# Altium schematic sheet POWER_SUPPLY_220V.SchDoc
size A1
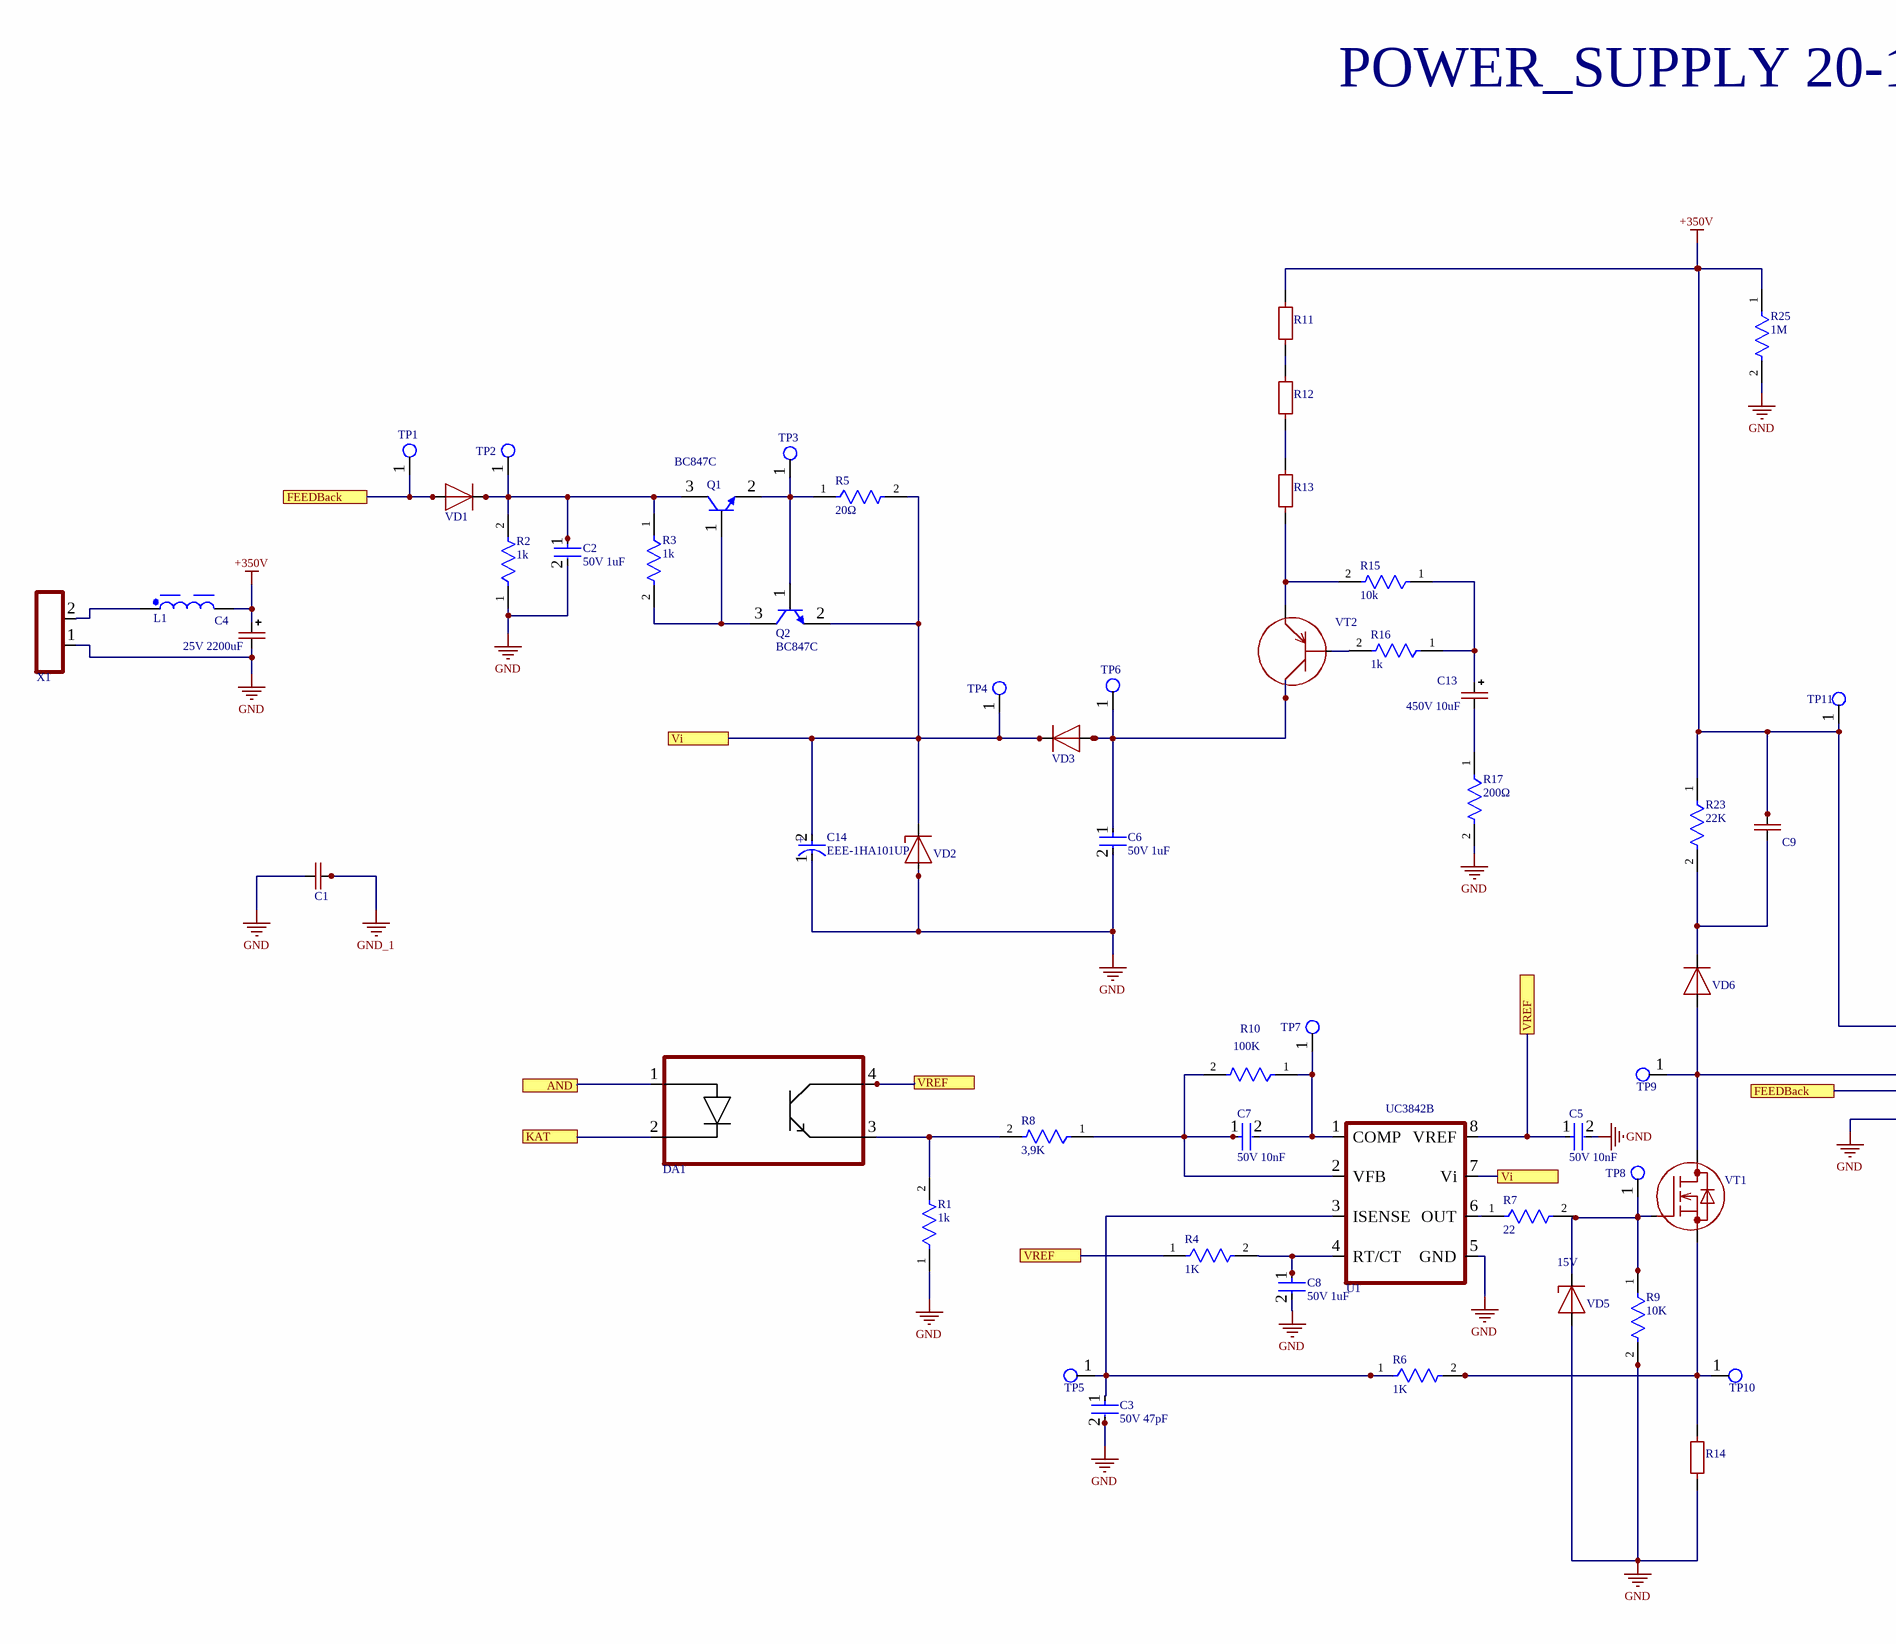
[diagram p0: POWER_SUPPLY_220V.SchDoc, left]
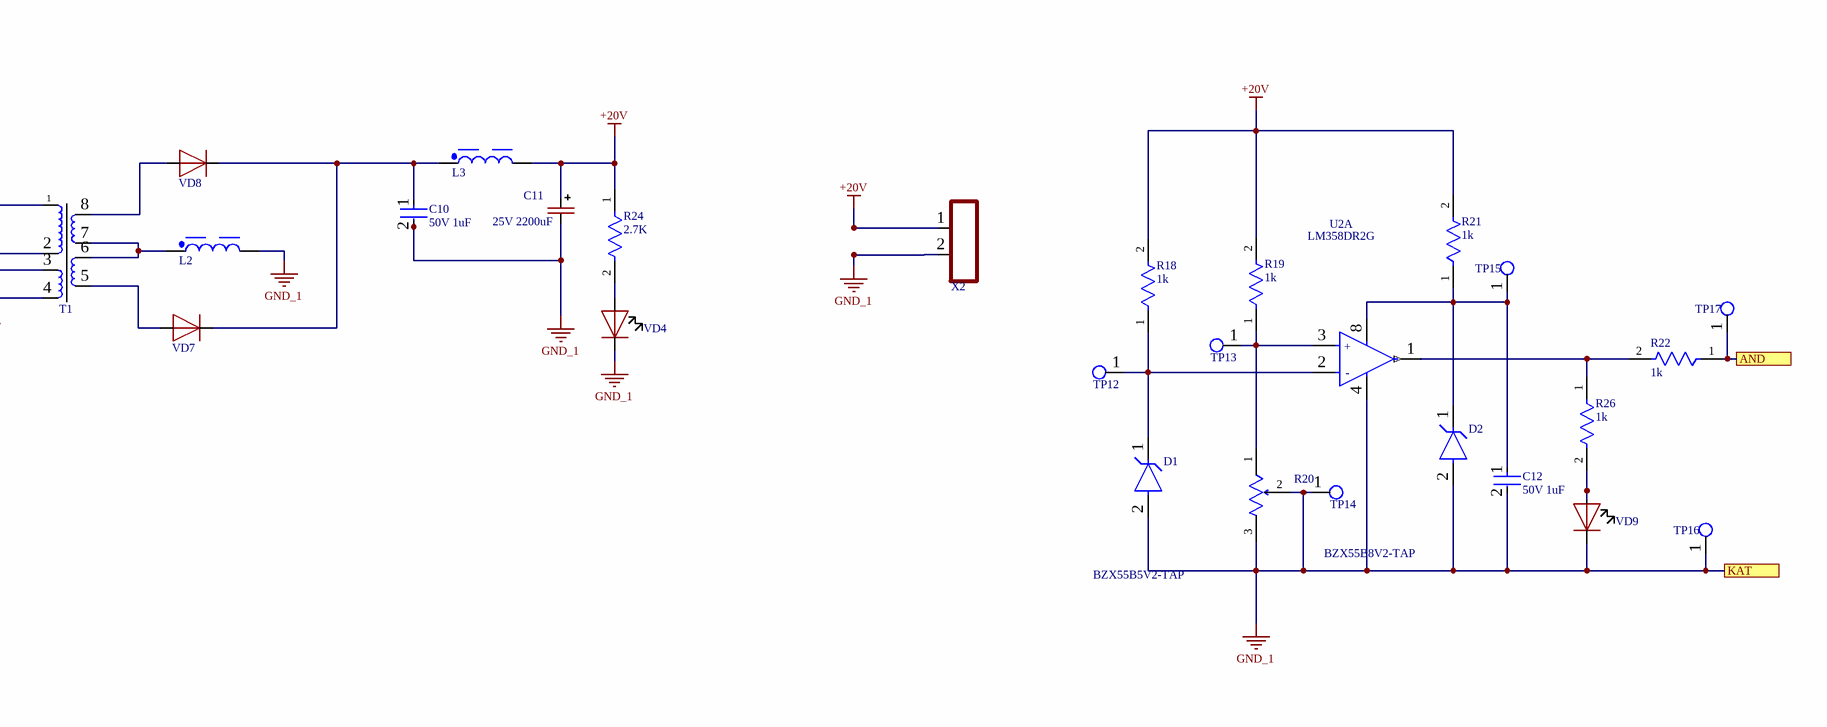
[diagram p1: POWER_SUPPLY_220V.SchDoc, right]

## Parts
C1  CAP-V  [CAP-V]  (value not drawn)
C2  50V 1uF  [FP-C0805C-DN-IPC_A]
C3  50V 47pF  [FP-C0805C-DN-IPC_A]
C4  25V 2200uF  [CAPPOL-12x25]
C5  50V 10nF  [FP-C0805C-DN-IPC_A]
C6  50V 1uF  [FP-C0805C-DN-IPC_A]
C7  50V 10nF  [FP-C0805C-DN-IPC_A]
C8  50V 1uF  [FP-C0805C-DN-IPC_A]
C9  CAP-V  [CAP-V]  (value not drawn)
C10  50V 1uF  [FP-C0805C-DN-IPC_A]
C11  25V 2200uF  [CAPPOL-12x25]
C12  50V 1uF  [FP-C0805C-DN-IPC_A]
C13  450V 10uF  [CAPPOL-12x25]
C14  EEE-1HA101UP  [FP-SF-MFG]
D1  BZX55B5V2-TAP  [FP-SB-V-3906_04-031_4-MFG]
D2  BZX55B8V2-TAP  [FP-SB-V-3906_04-031_4-MFG]
DA1  PC817  [4-SMD]  (value not drawn)
L1  470µH, 0.36A  [WE-PD2_7850]  (value not drawn)
L2  470µH, 0.36A  [WE-PD2_7850]  (value not drawn)
L3  470µH, 0.36A  [WE-PD2_7850]  (value not drawn)
Q1  BC847C  [INF-SOT23_L]
Q2  BC847C  [INF-SOT23_L]
R1  1k  [Vishay_CRCW0805-e3_IPC_A]
R2  1k  [Vishay_CRCW0805-e3_IPC_A]
R3  1k  [Vishay_CRCW0805-e3_IPC_A]
R4  1K  [Vishay_CRCW0805-e3_IPC_A]
R5  20Ω  [Vishay_CRCW0805-e3_IPC_A]
R6  1K  [Vishay_CRCW0805-e3_IPC_A]
R7  22  [Vishay_CRCW0805-e3_IPC_A]
R8  3,9K  [Vishay_CRCW0805-e3_IPC_A]
R9  10K  [Vishay_CRCW0805-e3_IPC_A]
R10  100K  [Vishay_CRCW0805-e3_IPC_A]
R11  RES-CONST  [RES-1206]  (value not drawn)
R12  RES-CONST  [RES-1206]  (value not drawn)
R13  RES-CONST  [RES-1206]  (value not drawn)
R14  RES-CONST  [RES-2W]  (value not drawn)
R15  10k  [Vishay_CRCW0805-e3_IPC_A]
R16  1k  [Vishay_CRCW0805-e3_IPC_A]
R17  200Ω  [Vishay_CRCW0805-e3_IPC_A]
R18  1k  [Vishay_CRCW0805-e3_IPC_A]
R19  1k  [Vishay_CRCW0805-e3_IPC_A]
R20  3296W-1-202LF  [Bourns_3296W_MFG]  (value not drawn)
R21  1k  [Vishay_CRCW0805-e3_IPC_A]
R22  1k  [Vishay_CRCW0805-e3_IPC_A]
R23  22K  [Vishay_CRCW0805-e3_IPC_A]
R24  2.7K  [Vishay_CRCW0805-e3_IPC_A]
R25  1M  [Vishay_CRCW0805-e3_IPC_A]
R26  1k  [Vishay_CRCW0805-e3_IPC_A]
T1  TRANS_RM6  [TRANS_RM6]  (value not drawn)
TP1  Test_Point_PCB  [Test_Point]  (value not drawn)
TP2  Test_Point_PCB  [Test_Point]  (value not drawn)
TP3  Test_Point_PCB  [Test_Point]  (value not drawn)
TP4  Test_Point_PCB  [Test_Point]  (value not drawn)
TP5  Test_Point_PCB  [Test_Point]  (value not drawn)
TP6  Test_Point_PCB  [Test_Point]  (value not drawn)
TP7  Test_Point_PCB  [Test_Point]  (value not drawn)
TP8  Test_Point_PCB  [Test_Point]  (value not drawn)
TP9  Test_Point_PCB  [Test_Point]  (value not drawn)
TP10  Test_Point_PCB  [Test_Point]  (value not drawn)
TP11  Test_Point_PCB  [Test_Point]  (value not drawn)
TP12  Test_Point_PCB  [Test_Point]  (value not drawn)
TP13  Test_Point_PCB  [Test_Point]  (value not drawn)
TP14  Test_Point_PCB  [Test_Point]  (value not drawn)
TP15  Test_Point_PCB  [Test_Point]  (value not drawn)
TP16  Test_Point_PCB  [Test_Point]  (value not drawn)
TP17  Test_Point_PCB  [Test_Point]  (value not drawn)
U1  UC3842B  [SOIC8-150]
U2  LM358DR2G  [FP-751-07-IPC_C]  (part A of 2)
VD1  DIODE  [DO-214AC, SMA]  (value not drawn)
VD2  ZENER  [017AA]  (value not drawn)
VD3  DIODE  [DO-214AC, SMA]  (value not drawn)
VD4  LED  [LED-0603]  (value not drawn)
VD5  15V  [DO-35]
VD6  DIODE  [DO-214AC, SMA]  (value not drawn)
VD7  DIODE  [DO-214AC, SMA]  (value not drawn)
VD8  DIODE  [DO-214AC, SMA]  (value not drawn)
VD9  LED  [LED-0603]  (value not drawn)
VT1  MOSFET-N-GDS  [TO-220(bend2)]  (value not drawn)
VT2  BIPOLAR-PNP-BCE  [SOT-223-3]  (value not drawn)
X1  CONN-2-PIN  [CONN]  (value not drawn)
X2  CONN-2-PIN  [CONN]  (value not drawn)

## Ports
AND, FEEDBack, KAT, Vi, VREF

## Nets
+20V: C11.1(+) L3.2 R18.2 R19.2 R21.2 R24.1 X2.1
+350V: C4.1(+) C9.2 L1.2 R11.2 R23.1 R25.1 T1.1 TP11.1(G9)
GND: C1.2 C2.2 C3.2 C4.2(-) C5.2 C6.2 C8.2 C14.1(C) R1.1 R2.1 R9.2 R14.1 R17.2 R25.2 T1.4 U1.5(GND) VD2.2(A) VD5.2(A) X1.1
GND_1: C1.1 C10.2 C11.2(-) C12.2 D1.2(A) D2.2(A) DA1.2(CATHODE) L2.2 R20.2(WIPER) R20.3(CW) TP14.1(G9) TP16.1(G9) U2.4(VEE/GND) VD4.1(C) VD9.1(C) X2.2 ; port KAT
AND: DA1.1(ANODE) R22.1 TP17.1(G9) ; port AND
FEEDBack: T1.3 TP1.1(G9) VD1.2(A) ; port FEEDBack
Vi: C14.2(A) Q2.2(E) R5.2 TP4.1(G9) U1.7(Vi) VD2.1(C) VD3.1(C) ; port Vi
VREF: C5.1 DA1.4(COLLECTOR) R4.1 U1.8(VREF) ; port VREF
NetC2_1: C2.1 Q1.3(C) R2.2 R3.1 TP2.1(G9) VD1.1(C)
NetC3_1: C3.1 R6.1 TP5.1(G9) U1.3(ISENSE)
NetC6_1: C6.1 TP6.1(G9) VD3.2(A) VT2.2(C)
NetC7_1: C7.1 R8.1 R10.2 U1.2(VFB)
NetC7_2: C7.2 R10.1 TP7.1(G9) U1.1(COMP)
NetC8_1: C8.1 R4.2 U1.4(RT/CT)
NetC9_1: C9.1 R23.2 VD6.1(C)
NetC10_1: C10.1 L3.1 VD7.1(C) VD8.1(C)
NetC12_1: C12.1 D2.1(C) R21.1 TP15.1(G9) U2.8(VCC)
NetC13_1: C13.1(+) R15.1 R16.1
NetC13_2: C13.2(-) R17.1
NetD1_1: D1.1(C) R18.1 TP12.1(G9) U2.2(INPUT_A-)
NetDA1_3: DA1.3(EMITTER) R1.2 R8.2
NetL1_1: L1.1 X1.2
NetL2_1: L2.1 T1.6 T1.7
NetQ1_1: Q1.1(B) Q2.3(C) R3.2
NetQ1_2: Q1.2(E) Q2.1(B) R5.1 TP3.1(G9)
NetR6_2: R6.2 R14.2 TP10.1(G9) VT1.3(S)
NetR7_1: R7.1 U1.6(OUT)
NetR7_2: R7.2 R9.1 TP8.1(G9) VD5.1(C) VT1.1(G)
NetR11_1: R11.1 R12.2
NetR12_1: R12.1 R13.2
NetR13_1: R13.1 R15.2 VT2.3(E)
NetR16_2: R16.2 VT2.1(B)
NetR19_1: R19.1 R20.1(CCW) TP13.1(G9) U2.3(INPUT_A+)
NetR22_2: R22.2 R26.1 U2.1(OUTPUT_A)
NetR24_2: R24.2 VD4.2(A)
NetR26_2: R26.2 VD9.2(A)
NetT1_2: T1.2 TP9.1(G9) VD6.2(A) VT1.2(D)
NetT1_5: T1.5 VD7.2(A)
NetT1_8: T1.8 VD8.2(A)

## Notes on the sheet
- POWER_SUPPLY 20-100V
- (in symbol CMP-1310-00291-2, part A) +; -
- (in symbol CMP-05427-000015-1) +

## Library data of the parts
C2 C3 C5-C8 C10 C12 = CMP-1036-04552-2: CAP CER 0.22UF 50V X7R 0805; Manufacturer: KEMET; Manufacturer Part Number: C0805C224K5RACTU; Value: 0.22 μF; Temperature Coefficient: 30ppm/°C; Material: Ceramic; Tolerance: 0.1; ComponentLink2URL: https://content.kemet.com/datasheets/KEM_C1003_C0G_SMD.pdf; Temperature Characteristic: X7R; Device Class L3: Ceramic Capacitors; Lead Free: Yes; Temperature: -55°C to +125°C; RoHS: TRUE; Capacitance: 0.22 μF; Automotive: No; Octopart: https://octopart.com/c0805c224k5ractu-kemet-144670; Temperature Range Low: -55°C; Height: 0.88mm; Device Class L1: Passive Components; Digikey Description: CAP CER 0.22UF 50V X7R 0805; ComponentLink2Description: Datasheet; Mouser Description: CAP CER 0.22UF 50V X7R 0805; Category: Cap; Ipc Land Pattern Name: CAPC200125X78; Temperature Range High: +125°C; Package: C0805C-DN; Device Class L2: Capacitors; Voltage Rating: 50 V
C4 C11 C13 = CAP-POLAR
C14 = CMP-05427-000015-1: CAP ALUM 100UF 20% 50V SMD; Manufacturer: Panasonic; Automotive Grade: Grade 3; Leakage Current: 100uA; Dissipation Factor: 0.12%; Life: 2000Hours; Ripple Current: 200mA; Material: Aluminum; ComponentLink2Description: Datasheet; Category: Cap; Voltage Rating: 50V; Value: 100uF; Octopart: https://octopart.com/eee-1ha101up-panasonic-55396734; Digikey Description: CAP ALUM 100UF 20% 50V SMD; Package: SF; RoHS: TRUE; Height: 10.5mm; ComponentLink2URL: https://industrial.panasonic.com/cdbs/www-data/pdf/RDE0000/ABA0000C1145.pdf; Tolerance: 20%; Mouser Description: Cap Aluminum Lytic 100uF 50V 20% (8 X 10.2mm) SMD 200mA 2000h 85C Automotive T/R; Device Class L2: Capacitors; Temperature Range High: +85°C; Lead Free: Yes; Device Class L3: Aluminum Electrolytic Capacitors; Device Class L1: Passive Components; Manufacturer Part Number: EEE-1HA101UP; Temperature: -40°C to +85°C; Automotive: Yes; Capacitance: 100uF; Voltage: 50V; Temperature Range Low: -40°C
D1 D2 = CMP-02541-000026-1: DIODE ZENER 8.2V 500MW DO35; Test Current: 5mA; Tolerance: 2%; Impedance: 7R; ESD Protection: No; Element Configuration: Single; Max Reverse Leakage Current: 100nA; Packaging: Ammo Pack; Case/Package: DO-35; Lead Free: Lead Free; Number of Pins: 2; Min Operating Temperature: -65°C; Contact Plating: Tin; Max Power Dissipation: 500mW; Radiation Hardening: No; Max Operating Temperature: 175°C; Mount: Through Hole; Package Quantity: 30000; Voltage Tolerance: 2%; Series: Automotive, AEC-Q101; Zener Voltage: 8.2V; RoHS Compliant: Yes; Power Dissipation: 500mW
L1-L3 = 744775247: WE-PD2 SMT Power Inductor, size 7850, 470µH, 0.36A, 1.96Ω; Manufacturer: Wurth Elektronik; Case/Size Code: 7850; DC Resistance: 1.37Ω; Saturation Current: 0.38A; Self Resonant Frequency: 3.4MHz; Manufacturer Part Number: 744775247; Category: Unshielded Power Inductors; Match Code: WE-PD2; ComponentLink1Description: Website Link; ComponentLink1URL: https://www.we-online.com/redexpert/article/744775247?ad; ComponentLink2Description: Datasheet Link; ComponentLink2URL: https://www.we-online.com/redexpert/spec/744775247?ad; Mount: Surface Mount; Operating Temperature Max: 125°C; Operating Temperature Min: -40°C; Packaging: Tape and Reel; Length: 7.8mm; Width: 7mm; Height: 4.95mm; DC Resistance Max: 1.96Ω; Inductance: 470µH; Rated Current: 0.36A
Q1 Q2 = BC847C: NPN Silicon AF Transistor, 45 V VCEO, 100 mA IC, SOT23, Reel, Green; Manufacturer: Infineon; Ptot (max): 330Â mW; VEBO (max): 6Â V; IBM (max): 200Â mA; VCBO (max): 50Â V; Green: TRUE; fT (typ): 250Â MHz; VCEO (max): 45Â V; IC (max): 100Â mA; ICBO (max): 15Â nA; Polarity: NPN; PartNumber: BC847C; PackageVersion: Apr-08; ComponentLink1Description: Manufacturer URL; ComponentLink2Description: Datasheet; ComponentLink3URL: http://www.infineon.com/dgdl/SOT23-Package_Overview.pdf?folderId=db3a30431936bc4b0119532290053c66&fileId=db3a30431936bc4b0119533468123c85; ComponentLink3Description: Package Specification; ComponentLink1URL: http://www.infineon.com/; Packing: Reel; ComponentLink2URL: http://www.infineon.com/dgdl/bc847series_bc848series_bc849series_bc850series.pdf?folderId=db3a304314dca389011541d30fa21656&fileId=db3a304314dca389011541d4630a1657; ICM (max): 200Â mA; Mounting Technology: Surface Mount; PackageReference: SOT23; PackageDescription: 3-Pin Small Outline Transistor Package, 1.3 x 2.9 mm Body, 0.95 mm Pitch
R1-R3 R5 R8 R10 R15-R19 R21-R23 R25 R26 = CRCW08050000Z0EA: 100k: *
R4 R6 R7 R9 R24 = CRCW08050000Z0EA: 100K; 100k: *
T1 = 4: №: 4; Value: XX; Part Number: 4
TP1-TP17 = TP_PCB?: Test_Point
U1 = UC3842B: №: 5; ID: I-0005; Part Number: UC3842B
U2 = CMP-1310-00291-2: IC OPAMP GP 2 CIRCUIT 8SOIC; Gain Bandwidth Product: 1MHz; Number of Circuits: 2; Min Supply Voltage: 3V; Slew Rate: 0.6V/µs; Max Dual Supply Voltage: 16V; Common Mode Rejection Ratio: 65dB; Input Bias Current: 250nA; Min Dual Supply Voltage: 1.5V; Dual Supply Voltage: 9V; Operating Supply Current: 1.5mA; Output Current: 40mA; Input Offset Voltage (Vos): 7mV; Nominal Supply Current: 1.2mA; Voltage Gain: 100dB; Max Supply Voltage: 32V; Width: 4mm; Number of Pins: 8; Min Operating Temperature: 0°C; REACH SVHC: No SVHC; Contact Plating: Tin; Lead Free: Lead Free; Halogen Free: Halogen Free; Power Supply Rejection Ratio (PSRR): 65dB; Operating Supply Voltage: 16V; Package Quantity: 2500; Max Operating Temperature: 70°C; Case/Package: SOIC; Height: 1.5mm; Packaging: Tape and Reel; Radiation Hardening: No; Number of Channels: 2; Bandwidth: 1MHz; Length: 5mm; Number of Elements: 2; Number of Amplifiers: 2; Output Current per Channel: 40mA
VD5 = ZENER
VT1 = IRF640_: №: 8; ID: T-0008; Value: 200V 18A; Part Number: IRF640_